# EAGLE schematic controller (EAGLE 9.6.2)

## Sheet 1 of 2: Logic
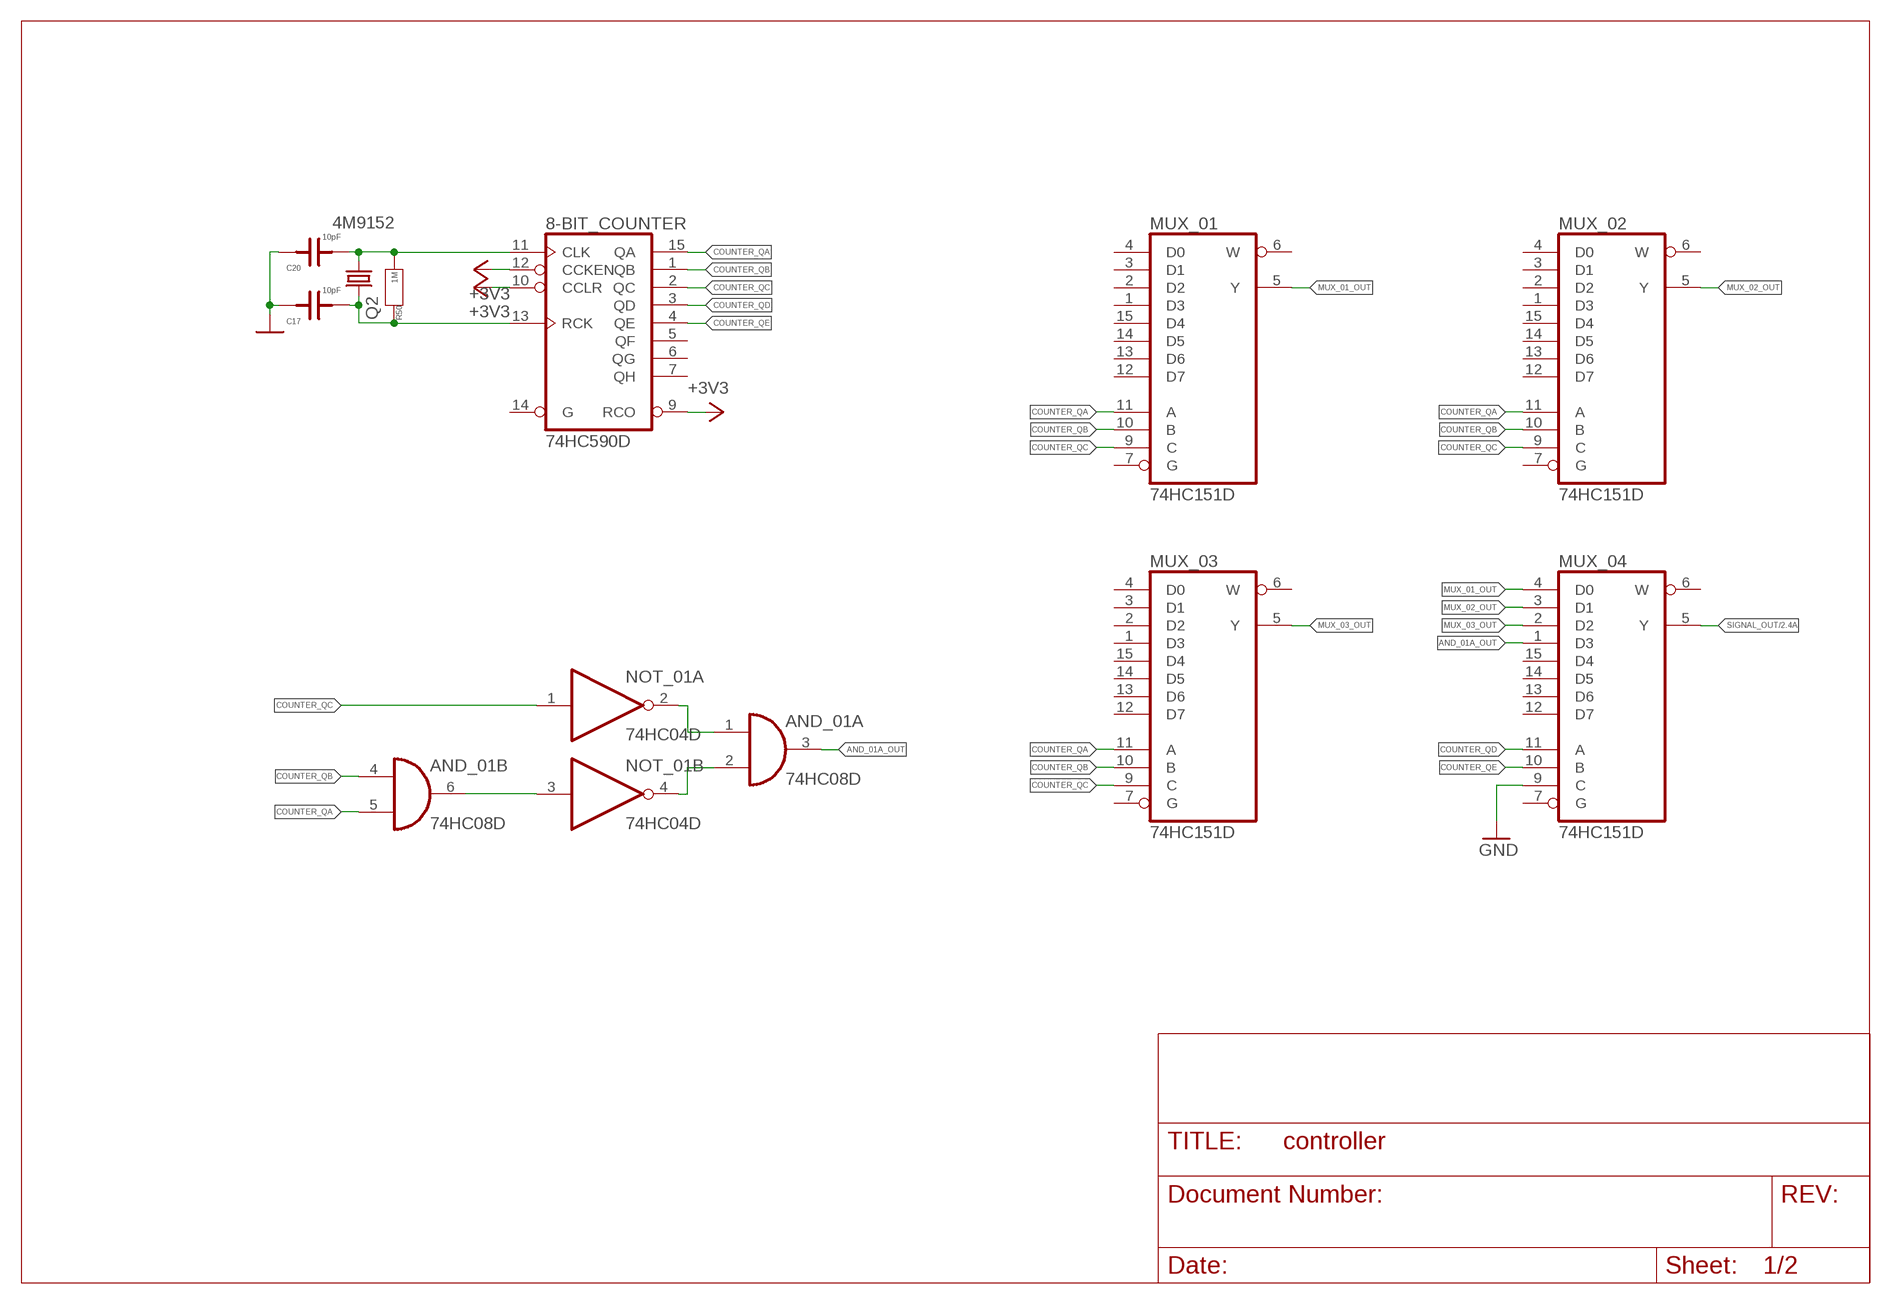
[diagram p0: schematic, sheet 1]

### Parts
8-BIT_COUNTER  74HC590D  [SO16]
AND_01  74HC08D  [SO14]
C17  10pF  C1  [0805F]
C20  10pF  C1  [0805F]
MUX_01  74HC151D  [SO16]
MUX_02  74HC151D  [SO16]
MUX_03  74HC151D  [SO16]
MUX_04  74HC151D  [SO16]
NOT_01  74HC04D  [SO14]
Q2  4M9152  HC49UP  [HC49UP]
R50  1M  R1  [0805]

### Nets
+3V3: 8-BIT_COUNTER.9(RCO) 8-BIT_COUNTER.10(CCLR) 8-BIT_COUNTER.12(CCKEN) ; also sheet 2
AND_01A_OUT: AND_01.3(A:O) MUX_04.1(D3)
COUNTER_QA: 8-BIT_COUNTER.15(QA) AND_01.5(B:I1) MUX_01.11(A) MUX_02.11(A) MUX_03.11(A)
COUNTER_QB: 8-BIT_COUNTER.1(QB) AND_01.4(B:I0) MUX_01.10(B) MUX_02.10(B) MUX_03.10(B)
COUNTER_QC: 8-BIT_COUNTER.2(QC) MUX_01.9(C) MUX_02.9(C) MUX_03.9(C) NOT_01.1(A:I)
COUNTER_QD: 8-BIT_COUNTER.3(QD) MUX_04.11(A)
COUNTER_QE: 8-BIT_COUNTER.4(QE) MUX_04.10(B)
EXTAL: 8-BIT_COUNTER.11(CLK) C20.1 Q2.1 R50.1
GND: C17.2 C20.2 MUX_04.9(C) ; also sheet 2
MUX_01_OUT: MUX_01.5(Y) MUX_04.4(D0)
MUX_02_OUT: MUX_02.5(Y) MUX_04.3(D1)
MUX_03_OUT: MUX_03.5(Y) MUX_04.2(D2)
N$2: 8-BIT_COUNTER.13(RCK) C17.1 Q2.2 R50.2
N$3: AND_01.6(B:O) NOT_01.3(B:I)
N$4: AND_01.1(A:I0) NOT_01.2(A:O)
N$5: AND_01.2(A:I1) NOT_01.4(B:O)
SIGNAL_OUT: MUX_04.5(Y) ; also sheet 2
Unconnected: 8-BIT_COUNTER.5(QF) 8-BIT_COUNTER.6(QG) 8-BIT_COUNTER.7(QH) 8-BIT_COUNTER.14(G) AND_01.8(C:O) AND_01.9(C:I0) AND_01.10(C:I1) AND_01.11(D:O) AND_01.12(D:I0) AND_01.13(D:I1) MUX_01.1(D3) MUX_01.2(D2) MUX_01.3(D1) MUX_01.4(D0) MUX_01.6(W) MUX_01.7(G) MUX_01.12(D7) MUX_01.13(D6) MUX_01.14(D5) MUX_01.15(D4) MUX_02.1(D3) MUX_02.2(D2) MUX_02.3(D1) MUX_02.4(D0) MUX_02.6(W) MUX_02.7(G) MUX_02.12(D7) MUX_02.13(D6) MUX_02.14(D5) MUX_02.15(D4) MUX_03.1(D3) MUX_03.2(D2) MUX_03.3(D1) MUX_03.4(D0) MUX_03.6(W) MUX_03.7(G) MUX_03.12(D7) MUX_03.13(D6) MUX_03.14(D5) MUX_03.15(D4) MUX_04.6(W) MUX_04.7(G) MUX_04.12(D7) MUX_04.13(D6) MUX_04.14(D5) MUX_04.15(D4) NOT_01.5(C:I) NOT_01.6(C:O) NOT_01.8(D:O) NOT_01.9(D:I) NOT_01.10(E:O) NOT_01.11(E:I) NOT_01.12(F:O) NOT_01.13(F:I)

## Sheet 2 of 2: Power & I/O
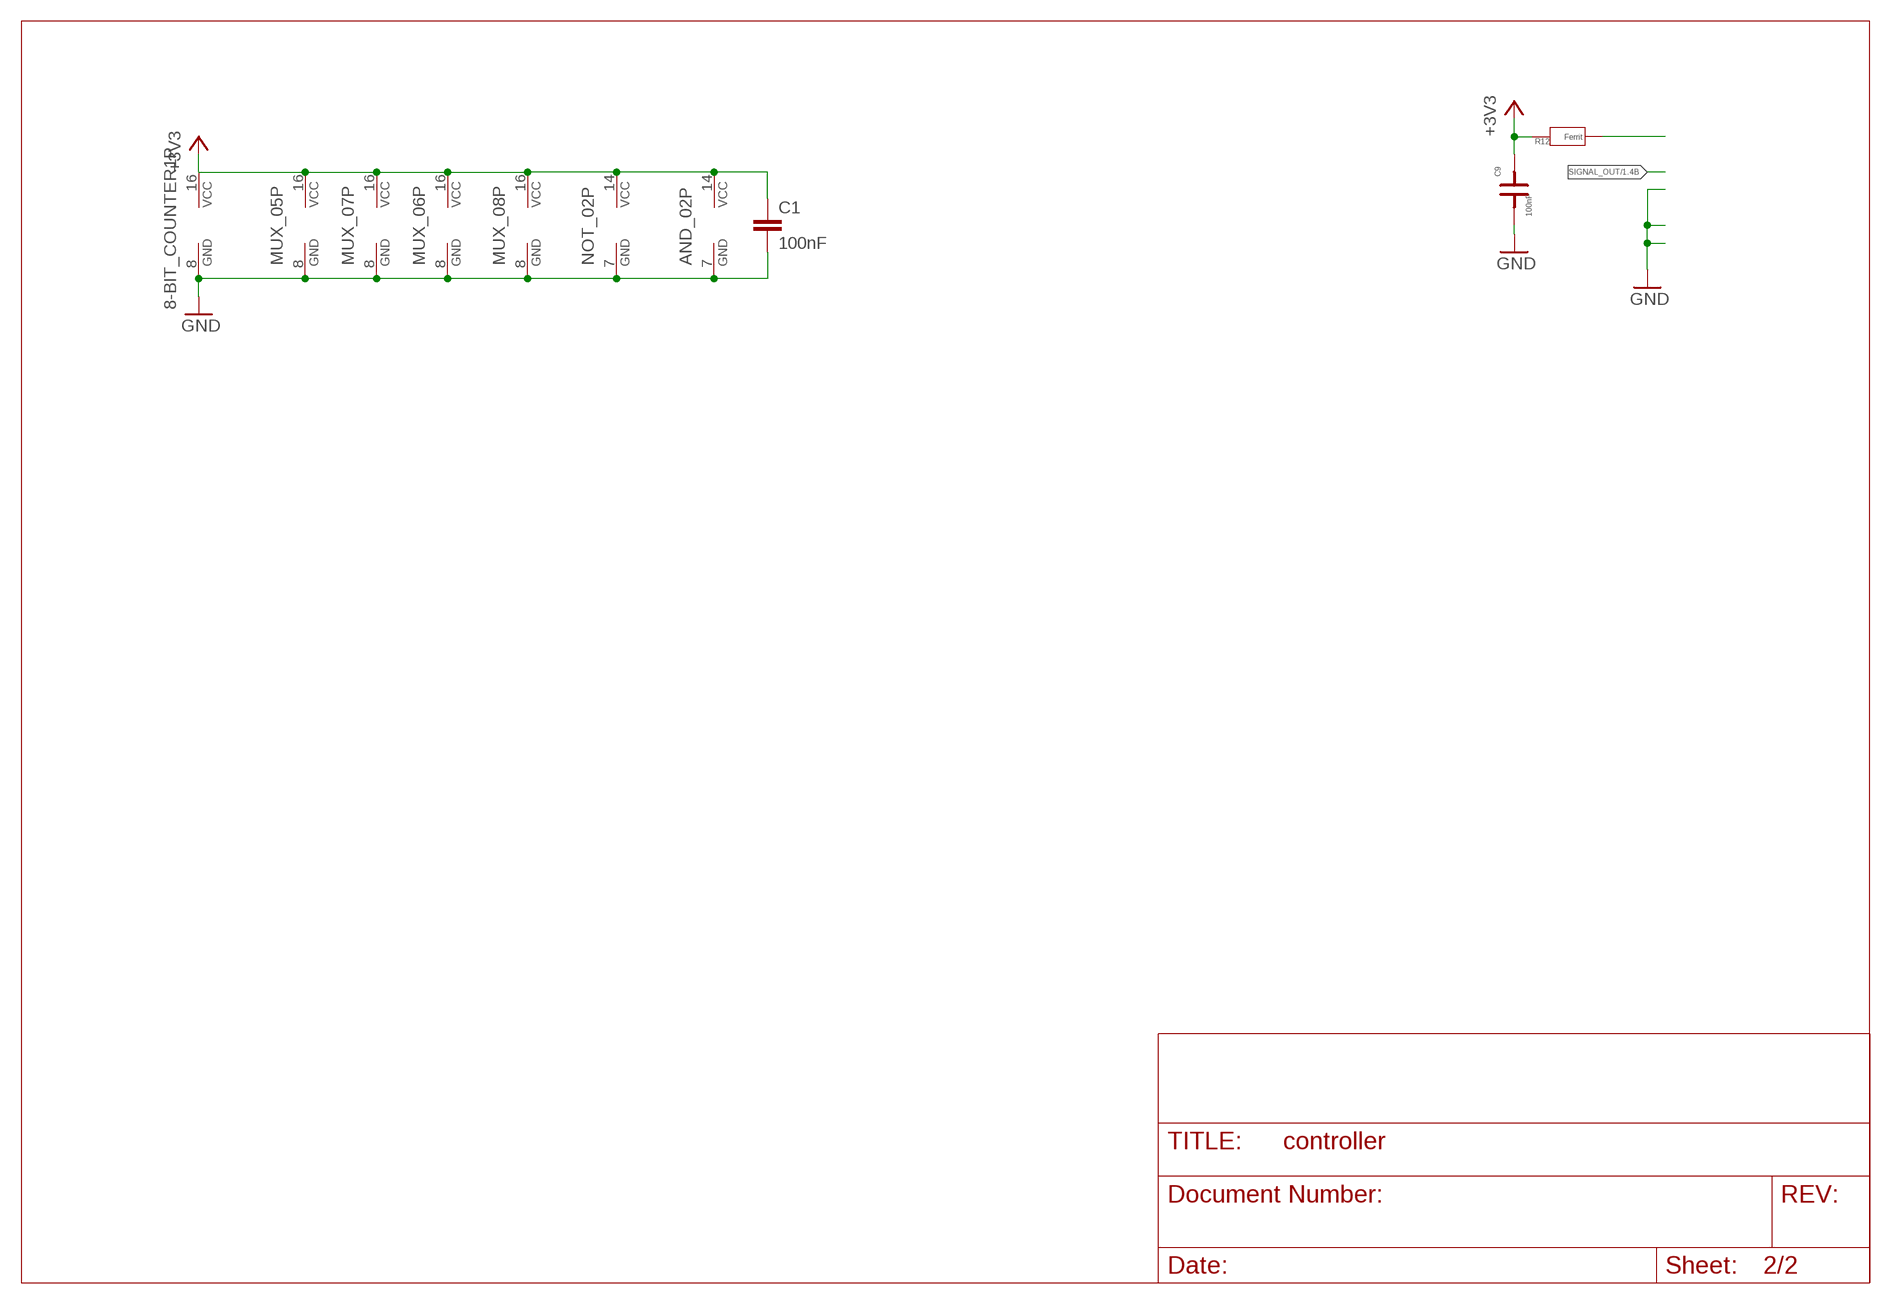
[diagram p1: schematic, sheet 2]

### Parts
8-BIT_COUNTER1  74HC590D  [SO16]
AND_02  74HC08D  [SO14]
C1  100nF  C-EUC0805  [C0805]
C9  100nF  C1  [0805F]
MUX_05  74HC151D  [SO16]
MUX_06  74HC151D  [SO16]
MUX_07  74HC151D  [SO16]
MUX_08  74HC151D  [SO16]
NOT_02  74HC04D  [SO14]
R12  Ferrit  R2  [1206]

### Nets
+3.3V: 8-BIT_COUNTER1.16(VCC) AND_02.14(P:VCC) C1.1 MUX_05.16(VCC) MUX_06.16(VCC) MUX_07.16(VCC) MUX_08.16(VCC) NOT_02.14(P:VCC)
+3V3: C9.2 R12.2 ; also sheet 1
GND: 8-BIT_COUNTER1.8(GND) AND_02.7(P:GND) C1.2 C9.1 MUX_05.8(GND) MUX_06.8(GND) MUX_07.8(GND) MUX_08.8(GND) NOT_02.7(P:GND) ; also sheet 1
N$1: R12.1
Unconnected: 8-BIT_COUNTER1.1(QB) 8-BIT_COUNTER1.2(QC) 8-BIT_COUNTER1.3(QD) 8-BIT_COUNTER1.4(QE) 8-BIT_COUNTER1.5(QF) 8-BIT_COUNTER1.6(QG) 8-BIT_COUNTER1.7(QH) 8-BIT_COUNTER1.9(RCO) 8-BIT_COUNTER1.10(CCLR) 8-BIT_COUNTER1.11(CLK) 8-BIT_COUNTER1.12(CCKEN) 8-BIT_COUNTER1.13(RCK) 8-BIT_COUNTER1.14(G) 8-BIT_COUNTER1.15(QA) AND_02.1(A:I0) AND_02.2(A:I1) AND_02.3(A:O) AND_02.4(B:I0) AND_02.5(B:I1) AND_02.6(B:O) AND_02.8(C:O) AND_02.9(C:I0) AND_02.10(C:I1) AND_02.11(D:O) AND_02.12(D:I0) AND_02.13(D:I1) MUX_05.1(D3) MUX_05.2(D2) MUX_05.3(D1) MUX_05.4(D0) MUX_05.5(Y) MUX_05.6(W) MUX_05.7(G) MUX_05.9(C) MUX_05.10(B) MUX_05.11(A) MUX_05.12(D7) MUX_05.13(D6) MUX_05.14(D5) MUX_05.15(D4) MUX_06.1(D3) MUX_06.2(D2) MUX_06.3(D1) MUX_06.4(D0) MUX_06.5(Y) MUX_06.6(W) MUX_06.7(G) MUX_06.9(C) MUX_06.10(B) MUX_06.11(A) MUX_06.12(D7) MUX_06.13(D6) MUX_06.14(D5) MUX_06.15(D4) MUX_07.1(D3) MUX_07.2(D2) MUX_07.3(D1) MUX_07.4(D0) MUX_07.5(Y) MUX_07.6(W) MUX_07.7(G) MUX_07.9(C) MUX_07.10(B) MUX_07.11(A) MUX_07.12(D7) MUX_07.13(D6) MUX_07.14(D5) MUX_07.15(D4) MUX_08.1(D3) MUX_08.2(D2) MUX_08.3(D1) MUX_08.4(D0) MUX_08.5(Y) MUX_08.6(W) MUX_08.7(G) MUX_08.9(C) MUX_08.10(B) MUX_08.11(A) MUX_08.12(D7) MUX_08.13(D6) MUX_08.14(D5) MUX_08.15(D4) NOT_02.1(A:I) NOT_02.2(A:O) NOT_02.3(B:I) NOT_02.4(B:O) NOT_02.5(C:I) NOT_02.6(C:O) NOT_02.8(D:O) NOT_02.9(D:I) NOT_02.10(E:O) NOT_02.11(E:I) NOT_02.12(F:O) NOT_02.13(F:I)

## Power pins joined to a net without a drawn wire
GND: 8-BIT_COUNTER.8(GND) AND_01.7(P:GND) MUX_01.8(GND) MUX_02.8(GND) MUX_03.8(GND) MUX_04.8(GND) NOT_01.7(P:GND)
VCC: 8-BIT_COUNTER.16(VCC) AND_01.14(P:VCC) MUX_01.16(VCC) MUX_02.16(VCC) MUX_03.16(VCC) MUX_04.16(VCC) NOT_01.14(P:VCC)

## Library data of the parts
8-BIT_COUNTER 8-BIT_COUNTER1 = 74xx-eu:74*590: 8-bit binary COUNTER, output register
AND_01 AND_02 = 74xx-eu:74*08: Quad 2-input AND gate
C1 = rcl:C-EU: CAPACITOR, European symbol; SPICEPREFIX: C
C9 C17 C20 = deto:C
MUX_01-MUX_08 = 74xx-eu:74*151: Data SELECTOR/MULTIPLEXER
NOT_01 NOT_02 = 74xx-eu:74*04: Hex INVERTER
Q2 = crystal:HC49UP: CRYSTAL
R12 R50 = deto:R: Widerstand 400 mil - 0805 - 1206